# EAGLE design PressureS (EAGLE 7.2.0)
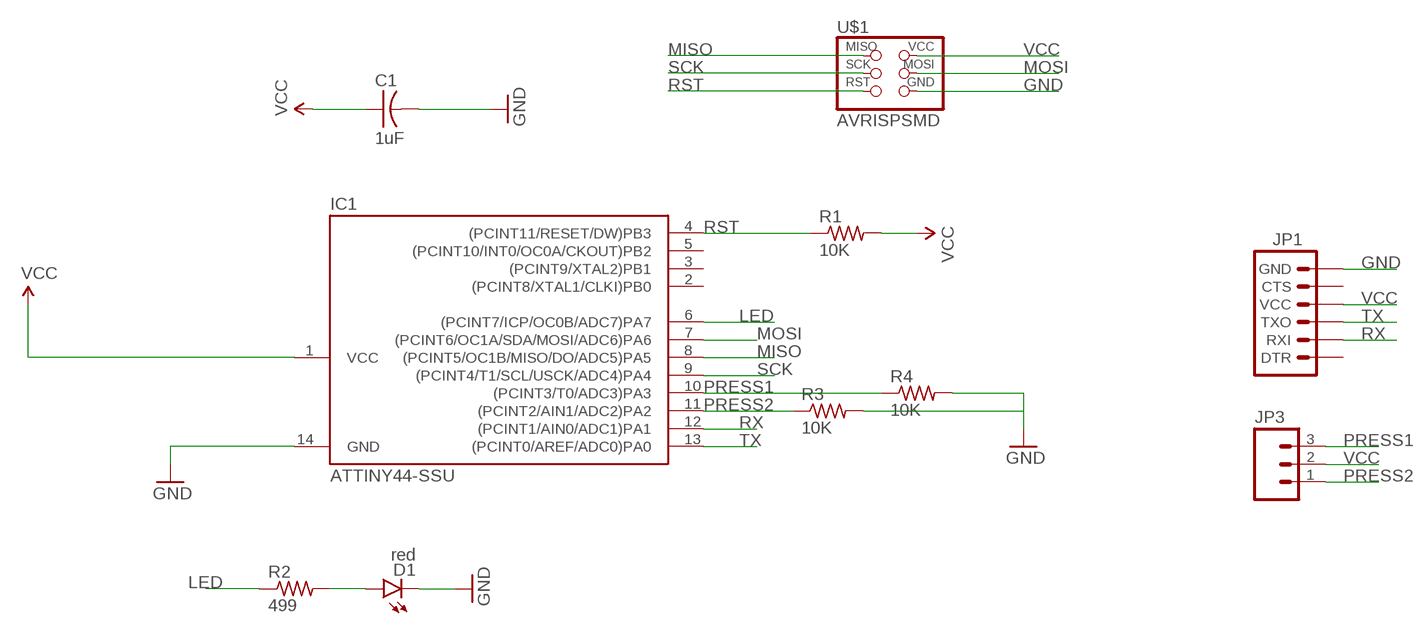
[diagram p0: schematic, sheet 1]

## Parts
C1  1uF  CAP-US1206FAB  [C1206FAB]
D1  red  LED1206  [LED-1206]
IC1  ATTINY44-SSU  [SOIC14]
JP1  ARDUINO_SERIAL_PROGRAMSMD  [1X06-SMD]
JP3  M03SMD_RA_MALE  [1X03_SMD_RA_MALE]
R1  10K  RES-US1206W  [R1206W]
R2  499  RES-US1206W  [R1206W]
R3  10K  RES-US1206W  [R1206W]
R4  10K  RES-US1206W  [R1206W]
U$1  AVRISPSMD  [2X03SMD]

## Nets
GND: C1.2 D1.C IC1.14(GND) JP1.6(GND) R3.2 R4.2 U$1.6(GND)
LED: IC1.6((PCINT7/ICP/OC0B/ADC7)PA7) R2.1
MISO: IC1.8((PCINT5/OC1B/MISO/DO/ADC5)PA5) U$1.1(MISO)
MOSI: IC1.7((PCINT6/OC1A/SDA/MOSI/ADC6)PA6) U$1.4(MOSI)
N$1: D1.A R2.2
PRESS1: IC1.10((PCINT3/T0/ADC3)PA3) JP3.3 R4.1
PRESS2: IC1.11((PCINT2/AIN1/ADC2)PA2) JP3.1 R3.1
RST: IC1.4((PCINT11/RESET/DW)PB3) R1.1 U$1.5(RST)
RX: IC1.12((PCINT1/AIN0/ADC1)PA1) JP1.2(RXI)
SCK: IC1.9((PCINT4/T1/SCL/USCK/ADC4)PA4) U$1.3(SCK)
TX: IC1.13((PCINT0/AREF/ADC0)PA0) JP1.3(TXO)
VCC: C1.1 IC1.1(VCC) JP1.4(VCC) JP3.2 R1.2 U$1.2(VCC)
Unconnected: IC1.2((PCINT8/XTAL1/CLKI)PB0) IC1.3((PCINT9/XTAL2)PB1) IC1.5((PCINT10/INT0/OC0A/CKOUT)PB2) JP1.1(DTR) JP1.5(CTS)

## Library data of the parts
C1 = fab:CAP-US
D1 = SparkFun-LED:LED: LEDs Standard schematic elements and footprints for 5mm, 3mm, 1206, and 0603 sized LEDs. 5mm - Spark Fun Electronics SKU : COM-00529 (and others)
IC1 = fab:ATTINY44
JP1 = SparkFun-Connectors:ARDUINO_SERIAL_PROGRAM: FTDI connector footprints
JP3 = SparkFun-Connectors:M03: Header 3 Standard 3-pin 0.1" header. Use with straight break away headers (SKU : PRT-00116), right angle break away headers (PRT-00553), swiss pins (PRT-00743), machine pins (PRT-00117), and female headers (PRT-00115). Molex polarized connector foot print use with SKU : PRT-08232 with associated crimp pins and housings.; PROD_ID: CONN-10925
R1-R4 = fab:RES-US: Resistor (US Symbol) Variants with postfix FAB are widened to allow the routing of internal traces
U$1 = fab:AVRISP

## Board
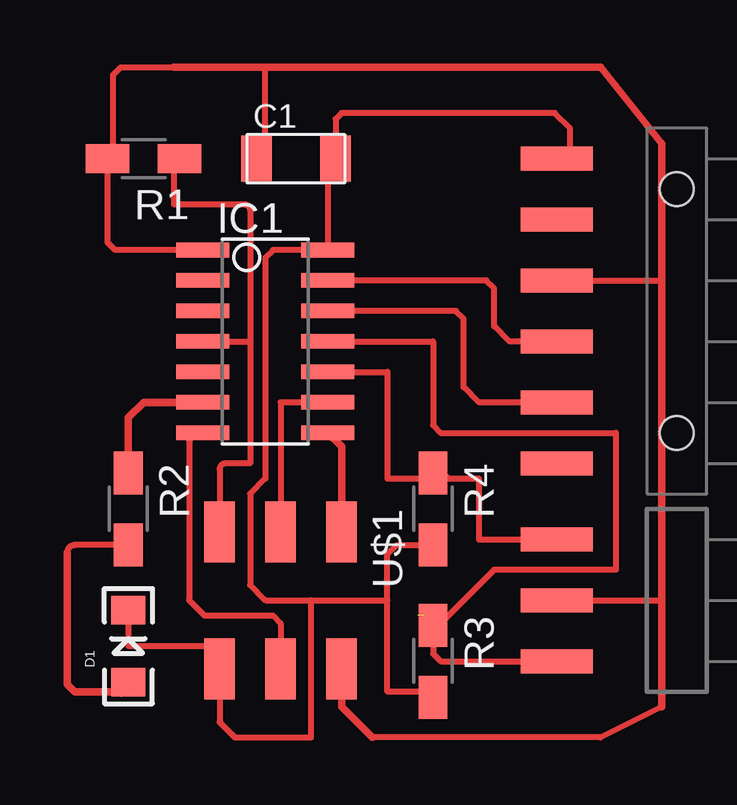
[diagram p1: board, top side]

No outline drawn. Coordinates in mm, seen from the top.
Copper layers (1*16): Top 0.035mm / dielectric 1.5mm / Bottom 0.035mm
Design rules "default": minimum track width 10mil, minimum drill 24mil, track to track 8mil, track to pad 8mil, pad to pad 8mil, via to via 8mil, smd to smd 8mil, copper to edge 40mil, drill to drill 8mil, minimum pad ring 10mil, minimum via ring 8mil, stop-mask expansion 4mil, vias tented up to drill 0mil, thermal gap 10mil

### Footprints (pad centres in the part's own frame; a part is rotated, then mirrored left to right if it is on the bottom)
C1206FAB = smd 1.27 x 1.905: 1 -1.651,0; 2 1.651,0
LED-1206 = smd 1.2 x 1.4: A -1.5,0; C 1.5,0
SOIC14 = smd 0.61 x 2.21: 1 -3.81,-2.603; 2 -2.54,-2.603; 3 -1.27,-2.603; 4 0,-2.603; 5 1.27,-2.603; 6 2.54,-2.603; 7 3.81,-2.603; 8 3.81,2.603; 9 2.54,2.603; 10 1.27,2.603; 11 0,2.603; 12 -1.27,2.603; 13 -2.54,2.603; 14 -3.81,2.603
1X06-SMD = smd 1 x 3: 1 -6.35,5; 2 -3.81,5; 3 -1.27,5; 4 1.27,5; 5 3.81,5; 6 6.35,5 | hole 1.4: -5.08,0; 5.08,0
1X03_SMD_RA_MALE = smd 1 x 3: 1 -2.54,5; 2 0,5; 3 2.54,5
R1206W = smd 1.8 x 1.2: 1 -1.499,0; 2 1.499,0
2X03SMD = smd 2.54 x 1.27: 1 -2.857,2.54; 2 2.857,2.54; 3 -2.857,0; 4 2.857,0; 5 -2.857,-2.54; 6 2.857,-2.54

### Placement (x,y rotation side)
C1  77.47,69.85 0 top
D1  70.48,49.53 90 top
IC1  76.2,62.23 270 top
JP1  93.34,63.5 90 top
JP3  93.34,51.44 90 top
R1  71.12,69.85 180 top
R2  70.48,55.24 270 top
R3  83.19,48.9 270 top
R4  83.19,55.24 270 top
U$1  76.83,51.44 270 top

### Tracks (layer width: path | path; a pad name or v marks a point on that pad's centre or on a via)
GND
  Top 0.254: JP1.6 88.9,69.85 88.9,71.12 88.27,71.75 79.38,71.75 79.12,71.5 C1.2 78.8,69.53 IC1.14 76.52,66.04 76.2,65.72 76.2,56.52 75.56,55.88 75.56,52.07 76.2,51.44 78.11,51.44 | D1.C 70.48,49.53 74.3,49.53 U$1.6 74.3,46.35 74.93,45.72 78.11,45.72 78.11,51.44 | 78.11,51.44 81.28,51.44 | R3.2 82.96,47.62 81.28,47.62 81.28,51.44 | 81.28,51.44 81.28,53.34 81.69,53.75 R4.2
LED
  Top 0.305: IC1.6 71.12,59.69 70.48,59.05 R2.1
MISO
  Top 0.305: IC1.8 79.38,57.85 U$1.1
MOSI
  Top 0.254: 73.66,58.42 73.34,58.42 73.03,58.1 73.03,51.44 73.66,50.8 76.52,50.8 76.83,50.48 U$1.4
  Top 0.305: 76.83,49.53 U$1.4 | IC1.7 73.66,58.42
N$1
  Top 0.254: R2.2 68.26,53.75 arc90 67.94,53.43
  Top 0.305: 67.94,53.43 67.94,47.94 68.26,47.62 70.17,47.62
  Top 0.406: 70.17,47.62 arc90 70.48,47.94 D1.A
PRESS1
  Top 0.254: IC1.10 81.28,60.96 81.28,56.52 83.82,56.52 83.59,56.74 R4.1 83.41,56.52 85.09,56.52 85.09,53.98 JP3.3
PRESS2  (1 unrouted)
  Top 0.254: R3.1 82.78,50.8 | R3.1 83.19,49.21 83.5,48.9 JP3.1 | IC1.11 83.19,62.23 83.19,58.74 83.5,58.42 90.81,58.42 90.81,52.7 85.72,52.7 83.41,50.39 R3.1
RST
  Top 0.254: 73.03,69.85 72.64,69.85 arc90 72.39,69.6 72.39,67.94 75.31,67.94 arc-90 75.56,67.69 75.56,62.23 | 75.56,62.23 75.56,57.15 74.55,57.15 arc90 74.3,56.9 U$1.5 | IC1.4 75.56,62.23
  Top 0.406: R1.1 73.03,69.85
RX
  Top 0.254: JP1.2 85.09,59.69 84.45,60.33 84.45,63.18 84.14,63.5 IC1.12
SCK
  Top 0.254: IC1.9 76.83,59.69 U$1.3
TX
  Top 0.254: JP1.3 86.36,62.23 85.72,62.87 85.72,64.45 85.41,64.77 IC1.13
  Top 0.406: 88.27,62.23 JP1.3
VCC
  Top 0.254: 92.71,46.99 90.17,45.72 80.64,45.72 | C1.1 75.88,69.85 76.2,70.17 76.2,73.66 | IC1.1 69.94,66.04 69.62,66.36 R1.2 69.85,70.08 69.85,73.34 70.17,73.66 72.39,73.66 | JP1.4 92.71,64.77 | JP3.2 92.71,51.44
  Top 0.305: 72.39,73.66 76.2,73.66 90.17,73.66 92.71,70.48 92.71,64.77 92.71,51.44 92.71,46.99 | 80.64,45.72 79.38,46.99 U$1.2